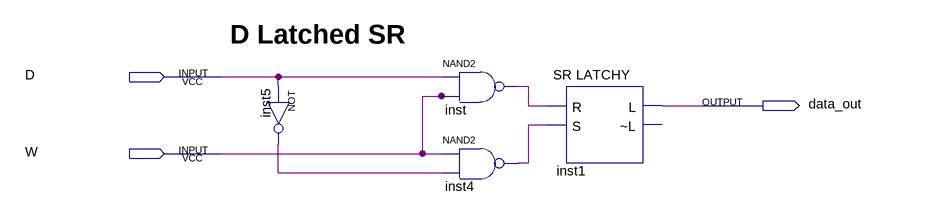
[diagram p0: schematic sheet]
// Quartus schematic D-Latched SR.bdf as structural Verilog: 4 symbols, 3 pins
module \D-Latched_SR  (
  input  D,
  input  W,
  output data_out
);

  wire inst4_out, inst5_out, inst_out;

  not inst5 (inst5_out, D);
  nand inst (inst_out, D, W);
  nand inst4 (inst4_out, W, inst5_out);
  \SR_LATCHY  inst1 (.R(inst_out), .S(inst4_out), .L(data_out));  // open: ~L

  // Notes on the sheet:
  //   D Latched SR
endmodule
